# Altium schematic sheet Bernardo_01.SchDoc: Bernardo
size A3; Date: 14/11/2018; DrawnBy: Wim Van Gool; Revision: 01; SheetNumber: 1; SheetTotal: 7
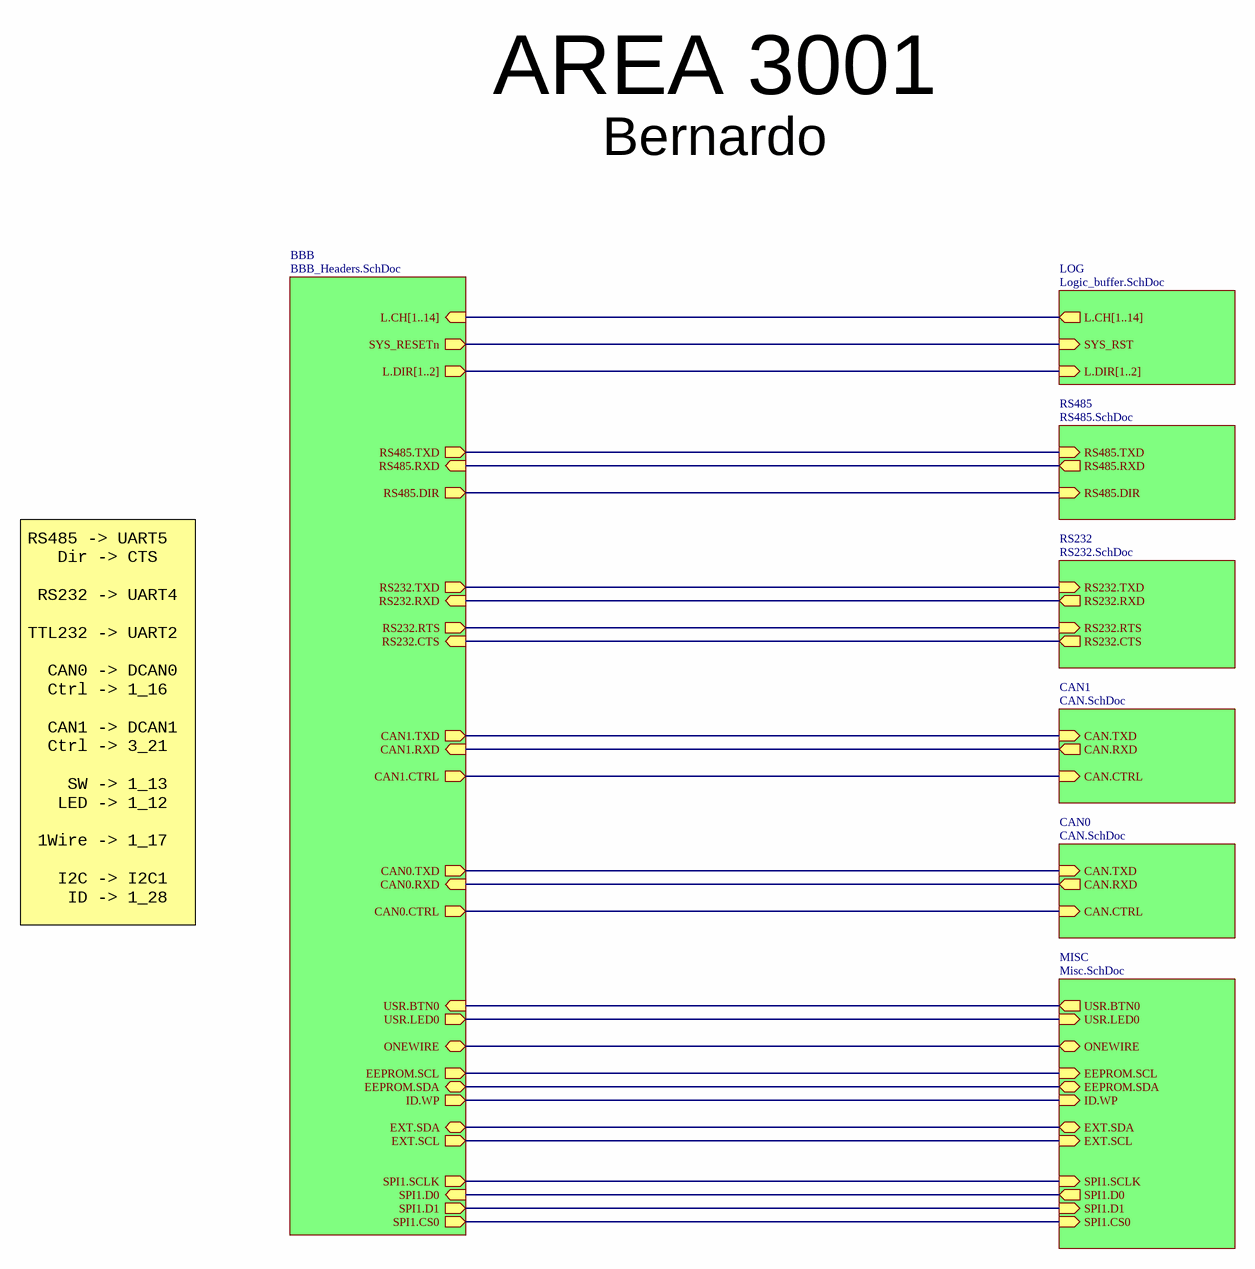
[diagram p0: Bernardo_01.SchDoc]

## Sub-sheets
BBB = BBB_Headers.SchDoc: RS485.TXD (out), RS485.RXD (in), RS485.DIR (out), USR.BTN0 (in), USR.LED0 (out), EEPROM.SCL (out), EEPROM.SDA (bidir), ID.WP (out), EXT.SDA (bidir), EXT.SCL (out), L.CH[1..14] (in), SYS_RESETn (out), RS232.TXD (out), RS232.RXD (in), RS232.RTS (out), RS232.CTS (in), SPI1.CS0 (out), SPI1.D1 (out), SPI1.SCLK (out), SPI1.D0 (in), L.DIR[1..2] (out), CAN1.RXD (in), CAN1.TXD (out), CAN1.CTRL (out), ONEWIRE (bidir), CAN0.RXD (in), CAN0.TXD (out), CAN0.CTRL (out)
CAN0 = CAN.SchDoc: CAN.CTRL (in), CAN.RXD (out), CAN.TXD (in)
CAN1 = CAN.SchDoc: CAN.CTRL (in), CAN.RXD (out), CAN.TXD (in)
LOG = Logic_buffer.SchDoc: L.CH[1..14] (out), SYS_RST (in), L.DIR[1..2] (in)
MISC = Misc.SchDoc: USR.BTN0 (out), USR.LED0 (in), EEPROM.SDA (bidir), EEPROM.SCL (in), ID.WP (in), EXT.SDA (bidir), EXT.SCL (in), SPI1.SCLK (in), SPI1.D0 (out), SPI1.D1 (in), SPI1.CS0 (in), ONEWIRE (bidir)
RS232 = RS232.SchDoc: RS232.TXD (in), RS232.RXD (out), RS232.RTS (in), RS232.CTS (out)
RS485 = RS485.SchDoc: RS485.TXD (in), RS485.DIR (in), RS485.RXD (out)

## Nets
(unnamed): sheet MISC/USR.BTN0, sheet BBB/USR.BTN0
(unnamed): sheet MISC/USR.LED0, sheet BBB/USR.LED0
(unnamed): sheet MISC/EEPROM.SDA, sheet BBB/EEPROM.SDA
(unnamed): sheet MISC/EEPROM.SCL, sheet BBB/EEPROM.SCL
(unnamed): sheet MISC/ID.WP, sheet BBB/ID.WP
(unnamed): sheet MISC/EXT.SDA, sheet BBB/EXT.SDA
(unnamed): sheet MISC/EXT.SCL, sheet BBB/EXT.SCL
(unnamed): sheet MISC/SPI1.SCLK, sheet BBB/SPI1.SCLK
(unnamed): sheet MISC/SPI1.D0, sheet BBB/SPI1.D0
(unnamed): sheet MISC/SPI1.D1, sheet BBB/SPI1.D1
(unnamed): sheet MISC/SPI1.CS0, sheet BBB/SPI1.CS0
(unnamed): sheet MISC/ONEWIRE, sheet BBB/ONEWIRE
(unnamed): sheet RS485/RS485.TXD, sheet BBB/RS485.TXD
(unnamed): sheet RS485/RS485.DIR, sheet BBB/RS485.DIR
(unnamed): sheet RS485/RS485.RXD, sheet BBB/RS485.RXD
(unnamed): sheet BBB/SYS_RESETn, sheet LOG/SYS_RST
(unnamed): sheet BBB/RS232.TXD, sheet RS232/RS232.TXD
(unnamed): sheet BBB/RS232.RXD, sheet RS232/RS232.RXD
(unnamed): sheet BBB/RS232.RTS, sheet RS232/RS232.RTS
(unnamed): sheet BBB/RS232.CTS, sheet RS232/RS232.CTS
(unnamed): sheet BBB/CAN1.RXD, sheet CAN1/CAN.RXD
(unnamed): sheet BBB/CAN1.TXD, sheet CAN1/CAN.TXD
(unnamed): sheet BBB/CAN1.CTRL, sheet CAN1/CAN.CTRL
(unnamed): sheet BBB/CAN0.RXD, sheet CAN0/CAN.RXD
(unnamed): sheet BBB/CAN0.TXD, sheet CAN0/CAN.TXD
(unnamed): sheet BBB/CAN0.CTRL, sheet CAN0/CAN.CTRL

## Buses and harness runs
bus sheet BBB/L.CH[1..14] = sheet LOG/L.CH[1..14]
bus sheet BBB/L.DIR[1..2] = sheet LOG/L.DIR[1..2]

## Notes on the sheet
- AREA 3001
- Bernardo
- RS485 -> UART5
  Dir -> CTS
  RS232 -> UART4
  TTL232 -> UART2
  CAN0 -> DCAN0
  Ctrl -> 1_16
  CAN1 -> DCAN1
  Ctrl -> 3_21
  SW -> 1_13
  LED -> 1_12
  1Wire -> 1_17
  I2C -> I2C1
  ID -> 1_28
- Title
- Revision
- Date
- Dranw By
- Size
- A3
- Sheet
- of